# EAGLE design marquee-letter (EAGLE 9.3.0)
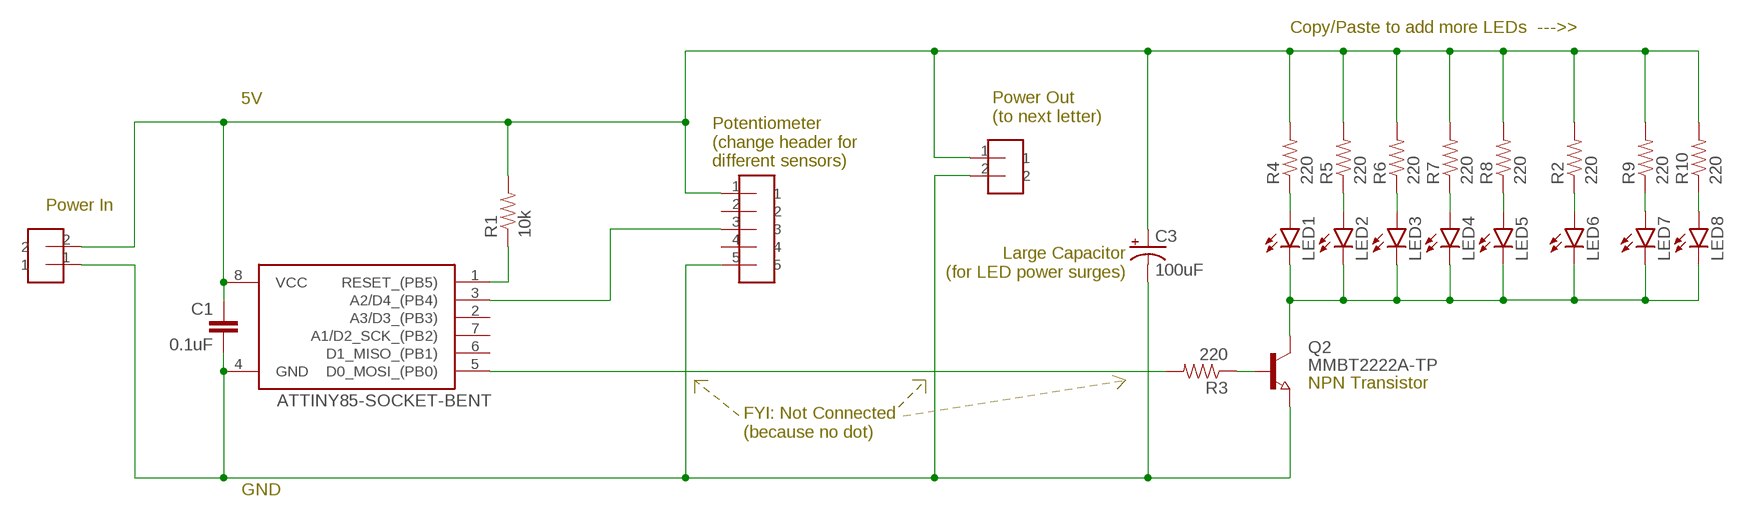
[diagram p0: schematic, sheet 1]

## Parts
C1  0.1uF  CAP-0805  [0805]
C3  100uF  CAP_POLD  [PANASONIC_D]
LED1  LED0603  [LED-0603]
LED2  LED0603  [LED-0603]
LED3  LED0603  [LED-0603]
LED4  LED0603  [LED-0603]
LED5  LED0603  [LED-0603]
LED6  LED0603  [LED-0603]
LED7  LED0603  [LED-0603]
LED8  LED0603  [LED-0603]
POTENTIOMETER  HEADER-5  [HEADER-5]
Q2  MMBT2222A-TP  TRANSISTOR-NPN-SOT23  [SOT23]
R1  10k  RESISTOR-0805  [0805]
R2  220  RESISTOR0603  [0603-RES]
R3  220  RESISTOR-0805  [0805]
R4  220  RESISTOR0603  [0603-RES]
R5  220  RESISTOR0603  [0603-RES]
R6  220  RESISTOR0603  [0603-RES]
R7  220  RESISTOR0603  [0603-RES]
R8  220  RESISTOR0603  [0603-RES]
R9  220  RESISTOR0603  [0603-RES]
R10  220  RESISTOR0603  [0603-RES]
U$1  ATTINY85-SOCKET-BENT  [SOCKET-8PIN-BENT]
U$2  HEADER-2  [HEADER-2]
U$3  HEADER-2  [HEADER-2]

## Nets
5V: C1.1 C3.+ POTENTIOMETER.1 R1.2 R2.2 R4.2 R5.2 R6.2 R7.2 R8.2 R9.2 R10.2 U$1.8(VCC) U$2.2 U$3.1
GND: C1.2 C3.- POTENTIOMETER.5 Q2.2(E) U$1.4(GND) U$2.1 U$3.2
N$1: LED1.A R4.1
N$2: LED6.A R2.1
N$3: R3.2 U$1.5(D0_MOSI_(PB0))
N$5: Q2.1(B) R3.1
N$6: LED1.C LED2.C LED3.C LED4.C LED5.C LED6.C LED7.C LED8.C Q2.3(C)
N$7: LED2.A R5.1
N$8: LED3.A R6.1
N$9: LED4.A R7.1
N$10: LED5.A R8.1
N$12: R1.1 U$1.1(RESET_(PB5))
N$15: LED8.A R10.1
N$16: LED7.A R9.1
SENSOR: POTENTIOMETER.3 U$1.3(A2/D4_(PB4))
Unconnected: POTENTIOMETER.2 POTENTIOMETER.4 U$1.2(A3/D3_(PB3)) U$1.6(D1_MISO_(PB1)) U$1.7(A1/D2_SCK_(PB2))

## Notes on the sheet
- Copy/Paste to add more LEDs  --->>
- 5V
- Power Out
  (to next letter)
- Potentiometer
  (change header for
  different sensors)
- Power In
- Large Capacitor
  (for LED power surges)
- NPN Transistor
- FYI: Not Connected
  (because no dot)
- GND

## Library data of the parts
C1 = homemade-hardware:CAP: Capacitor Standard 0603 ceramic capacitor, and 0.1" leaded capacitor.
C3 = homemade-hardware:CAP_POL: Capacitor Polarized These are standard SMD and PTH capacitors. Normally 10uF, 47uF, and 100uF in electrolytic and tantalum varieties. Always verify the external diameter of the through hole cap, it varies with capacity, voltage, and manufacturer. The EIA devices should be standard.
LED1-LED8 = homemade-hardware:LED: LEDs Standard schematic elements and footprints for 5mm, 3mm, 1206, and 0603 sized LEDs. 5mm - Spark Fun Electronics SKU : COM-00529 (and others)
POTENTIOMETER = homemade-hardware:HEADER-5
Q2 = homemade-hardware:TRANSISTOR-NPN: NPN Transistor BJT <https://www.digikey.com/product-detail/en/micro-commercial-co/MMBT2222A-TP/MMBT2222ATPMSCT-ND/717394>: MMBT2222A
R1-R10 = homemade-hardware:RESISTOR: Resistor Basic schematic elements and footprints for 0603, 1206, and PTH resistors.
U$1 = homemade-hardware:ATTINY85
U$2 U$3 = homemade-hardware:HEADER-2

## Board
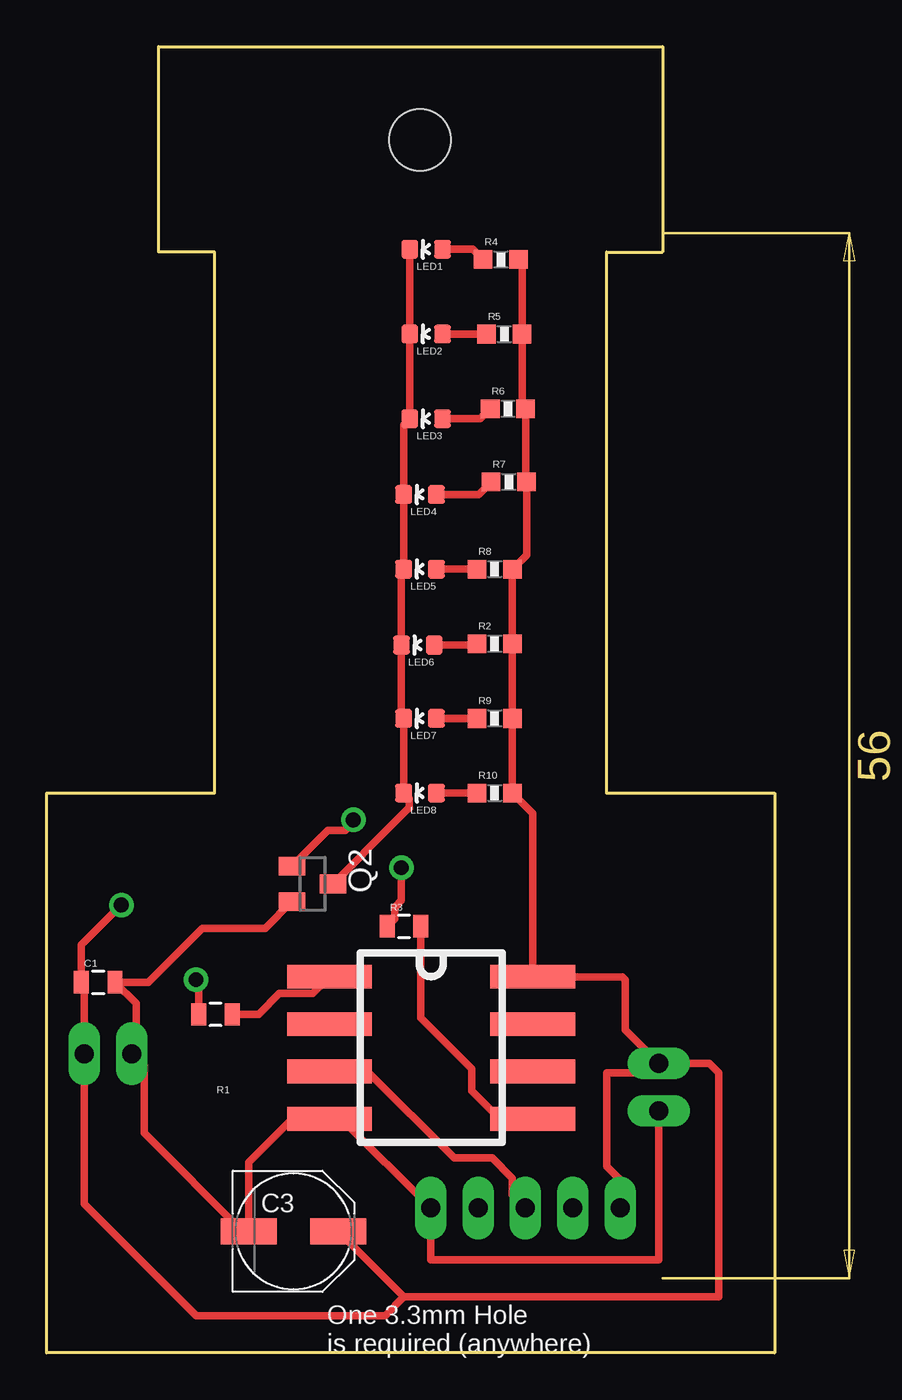
[diagram p1: board, top side]
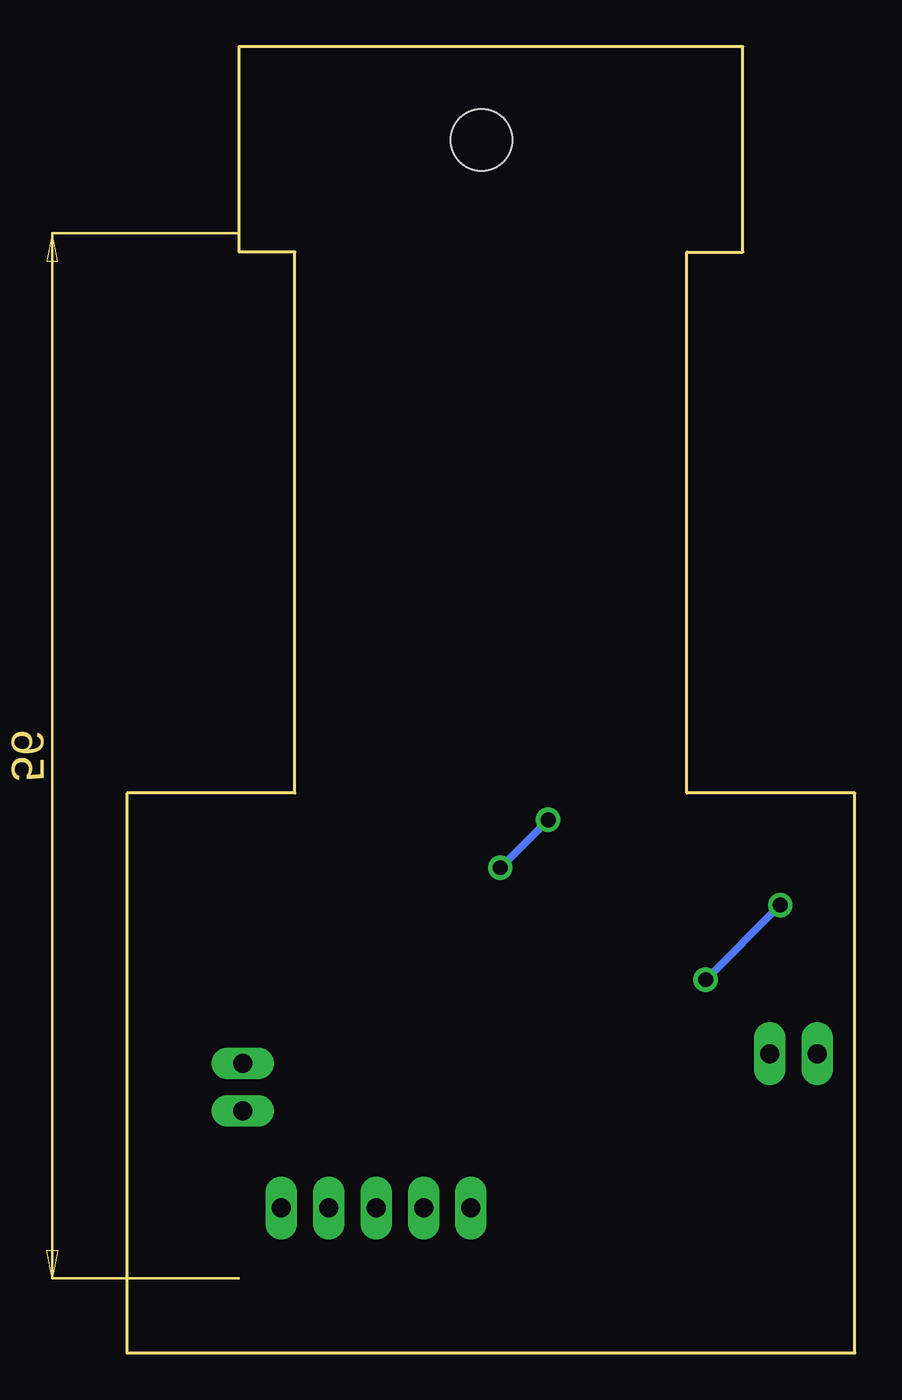
[diagram p2: board, bottom side, seen from below]

Size 39 x 70 mm. Coordinates in mm from the lower left corner, seen from the top.
Outline: 30,30 39,30 39,0 0,0 0,30 9,30 9,59 6,59 6,70 33,70 33,59 30,59 30,30
Copper layers (1*16): Top 0.035mm / dielectric 1.5mm / Bottom 0.035mm
Design rules "default": minimum track width 16mil, minimum drill 0.8mm, track to track 0.8mm, track to pad 0.8mm, pad to pad 0.8mm, via to via 0.8mm, smd to smd 0mil, copper to edge 1mil, drill to drill 1mil, minimum pad ring 10mil, minimum via ring 10mil, stop-mask expansion 1mil, vias tented up to drill 30mil, thermal gap 10mil
Holes 3.3 mm at 20,65

### Footprints (pad centres in the part's own frame; a part is rotated, then mirrored left to right if it is on the bottom)
0805 = smd 0.8 x 1.2: 1 -0.9,0; 2 0.9,0
PANASONIC_D = smd 3 x 1.4: + 2.4,0; - -2.4,0
LED-0603 = smd 1 x 0.9: A 0,-0.877; C 0,0.877
HEADER-5 = drill 1.016 pad 1.676 long: 1 0,0; 2 0,2.54; 3 0,5.08; 4 0,7.62; 5 0,10.16
SOT23 = smd 1 x 1.4: 1 -0.95,-1.1; 2 0.95,-1.1; 3 0,1.1
0603-RES = smd 1 x 1: 1 -0.95,0; 2 0.95,0
SOCKET-8PIN-BENT = smd 4.54 x 1.27: 1 -5.445,3.81; 2 -5.445,1.27; 3 -5.445,-1.27; 4 -5.445,-3.81; 5 5.445,-3.81; 6 5.445,-1.27; 7 5.445,1.27; 8 5.445,3.81
HEADER-2 = drill 1.016 pad 1.676 long: 1 0,0; 2 0,2.54

### Placement (x,y rotation side)
C1  2.76,19.86 0 top
C3  13.22,6.51 0 top
LED1  20.33,59.14 90 top
LED2  20.33,54.6 90 top
LED3  20.33,50.06 90 top
LED4  20,46 90 top
LED5  20,42 90 top
LED6  19.88,37.93 90 top
LED7  20,34 90 top
LED8  20,30 90 top
POTENTIOMETER  30.73,7.76 90 top
Q2  14.24,25.13 270 top
R1  9.05,18.14 180 top
R2  24,38 0 top
R3  19.14,22.86 0 top
R4  24.33,58.59 0 top
R5  24.52,54.59 0 top
R6  24.71,50.59 0 top
R7  24.76,46.67 0 top
R8  24,42 0 top
R9  24,34 0 top
R10  24,30 0 top
U$1  20.6,16.35 0 top
U$2  32.79,12.97 0 top
U$3  2.02,16.03 270 top

### Tracks (layer width: path | path; a pad name or v marks a point on that pad's centre or on a via)
5V  (via drill 0.8)
  Top 0.406: R4.2 25.47,58.4 R5.2 25.47,50.78 R6.2 25.66,46.72 R7.2 25.71,42.76 R8.2 R2.2 R9.2 R10.2 26.05,28.91 U$1.8 30.84,20.16 31,20 31,17.3 U$2.2 | U$2.2 32.79,15.41 | U$2.2 32.28,15 30,15 30,10 30.73,9.27 POTENTIOMETER.1 | U$2.2 35.49,15.51 36,15 36,3 19.13,3 | 19.13,3 C3.+ | 19.13,3 18.13,2 8,2 2,8 2,15 2.02,15.02 U$3.1 2.02,19.7 C1.1 1.86,21.86 v4,24 | R1.2 8.15,19.85 v8,20
  Bottom 0.406: v8,20 v4,24
GND
  Top 0.406: U$2.1 32.79,5 20.57,5 POTENTIOMETER.5 15.79,12.54 U$1.4 13.16,12.54 10.82,10.21 C3.- 10.82,6.82 | 10.82,6.82 10.5,6.5 5.22,11.78 5.22,15.37 4.79,15.79 | 11,7 10.82,6.82 | U$3.2 4.79,15.79 | 4.79,15.79 4.79,18.73 C1.2 5.45,19.86 8.33,22.74 11.7,22.74 Q2.2
N$1
  Top 0.406: R4.1 22.83,59.14 LED1.A
N$2
  Top 0.406: R2.1 22.98,37.93 LED6.A
N$3
  Top 0.406: U$1.5 24.26,12.54 22.77,14.03 22.77,15.23 20.04,17.96 R3.2
N$5  (via drill 0.8)
  Top 0.406: Q2.1 15.06,28 16,28 16.43,28.43 v16.43,28.57 | v19,26 19,24.24 18.64,23.88 18.64,23.26 R3.1
  Bottom 0.406: v16.43,28.57 v19,26
N$6
  Top 0.406: LED1.C LED2.C LED3.C 19.12,49.73 LED4.C LED5.C 19,41.88 LED6.C 19,34.12 LED7.C LED8.C 19.42,29.7 19.42,29.16 19.37,29.16 18.71,28.5 18.61,28.39 Q2.3
N$7
  Top 0.406: R5.1 LED2.A
N$8
  Top 0.406: R6.1 23.23,50.06 LED3.A
N$9
  Top 0.406: R7.1 23.14,46 LED4.A
N$10
  Top 0.406: R8.1 LED5.A
N$12
  Top 0.406: U$1.1 14.25,19.26 12.47,19.26 11.35,18.14 R1.1
N$15
  Top 0.406: R10.1 LED8.A
N$16
  Top 0.406: R9.1 LED7.A
SENSOR
  Top 0.406: U$1.3 17.18,15.08 21.82,10.44 23.87,10.44 24.95,9.36 24.95,8.46 POTENTIOMETER.3

### Text on the board
tPlace: One 3.3mm Hole / is required (anywhere)